# Altium schematic sheet as5047u.SchDoc
size A; SheetNumber: 1; SheetTotal: 1
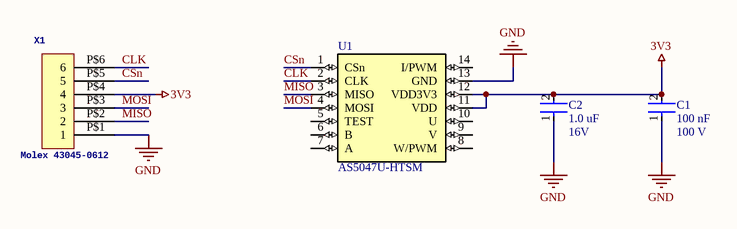
[diagram p0: as5047u.SchDoc]

## Parts
C1  Capacitance: 100 nF  Voltage: 100 V  [CAP-0603]  (hidden comment: CC0603KRX7R0BB104)
C2  Capacitance: 1.0 uF  Voltage: 16V  [CAP-0603]  (hidden comment: CC0603KRX7R7BB105)
U1  AS5047U-HTSM  [SOP65P640X110-14N]
X1  Molex 43045-0612  [43045-0612]

## Nets
3V3: C1.2 C2.2 U1.11(VDD) U1.12(VDD3V3) X1.P$4(4)
GND: C1.1 C2.1 U1.13(GND) X1.P$1(1)
CLK: U1.2(CLK) X1.P$6(6)
CSn: U1.1(CSn) X1.P$5(5)
MISO: U1.3(MISO) X1.P$2(2)
MOSI: U1.4(MOSI) X1.P$3(3)

Not connected (* = marked no-connect by the designer): U1 5(TEST) 6(B) 7(A) 8(W/PWM) 9(V) 10(U) 14(I/PWM)

## Library data of the parts
C1 = CAP-100N-0001: CAP CER 0.1UF 100V X7R 0603; Device Class: Ceramic; Size: 0603; ComponentLink1Description: Datasheet; ComponentLink1URL: https://www.yageo.com/upload/media/product/app/datasheet/mlcc/upy-np0x7r_mv_100-to-630v.pdf
C2 = CAP-1U-0002: CAP CER 1UF 16V X7R 0603; Device Class: Ceramic; Size: 0603
U1 = IC-ABSENC-0001: Hall Effect Sensor Rotary Position External Magnet, Not Included Gull Wing; MF: ams; MP: AS5047D-ATSM; SnapEDA_Link: https://www.snapeda.com/parts/AS5047D-ATSM/ams/view-part/?ref=snap; Package: TSSOP-14 ams; Value: *; Check_prices: https://www.snapeda.com/parts/AS5047D-ATSM/ams/view-part/?ref=eda; ComponentLink1Description: Datasheet; ComponentLink1URL: https://www.mouser.com/datasheet/3/5912/1/AS5047U_DS000637_1_01.pdf
X1 = Micro-Fit Molex 6 Pin 2 Row Vertical: GateName_1: G$1; SymbolName_1: HEADER_POS6; DeviceSetName: HEADER_POS6_?; DeviceName: 43045-0612; LibraryName: con-molex-micro-fit-3_0_2; Package: 43045-0612